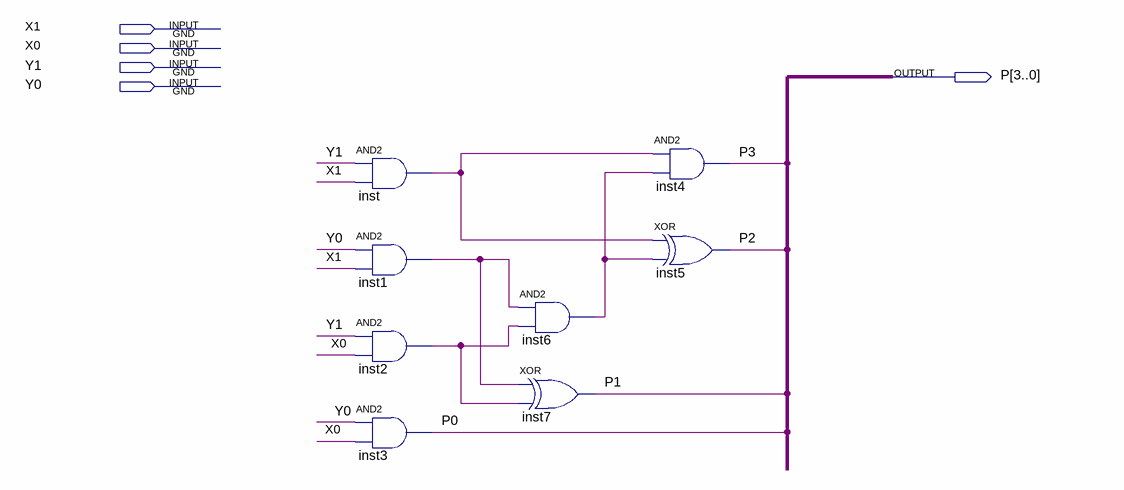
[diagram p0: schematic sheet]
// Quartus schematic 2bit_Multipler.bdf as structural Verilog: 8 symbols, 5 pins
module \2bit_Multipler  (
  input  X1,
  input  X0,
  input  Y1,
  input  Y0,
  output [3:0] P
);

  wire inst1_out, inst2_out, inst6_out, inst_out;

  and inst (inst_out, Y1, X1);
  and inst1 (inst1_out, Y0, X1);
  and inst2 (inst2_out, Y1, X0);
  and inst3 (P[0], Y0, X0);
  and inst6 (inst6_out, inst1_out, inst2_out);
  xor inst7 (P[1], inst1_out, inst2_out);
  and inst4 (P[3], inst_out, inst6_out);
  xor inst5 (P[2], inst_out, inst6_out);
endmodule
